# EasyEDA schematic Kit Sumo Bot Final.json
TITLE: Kit Robot Sumo V1; REV: 1.0; Date: 2023-11-24; Sheet: 1/1; Company: @amccprojects
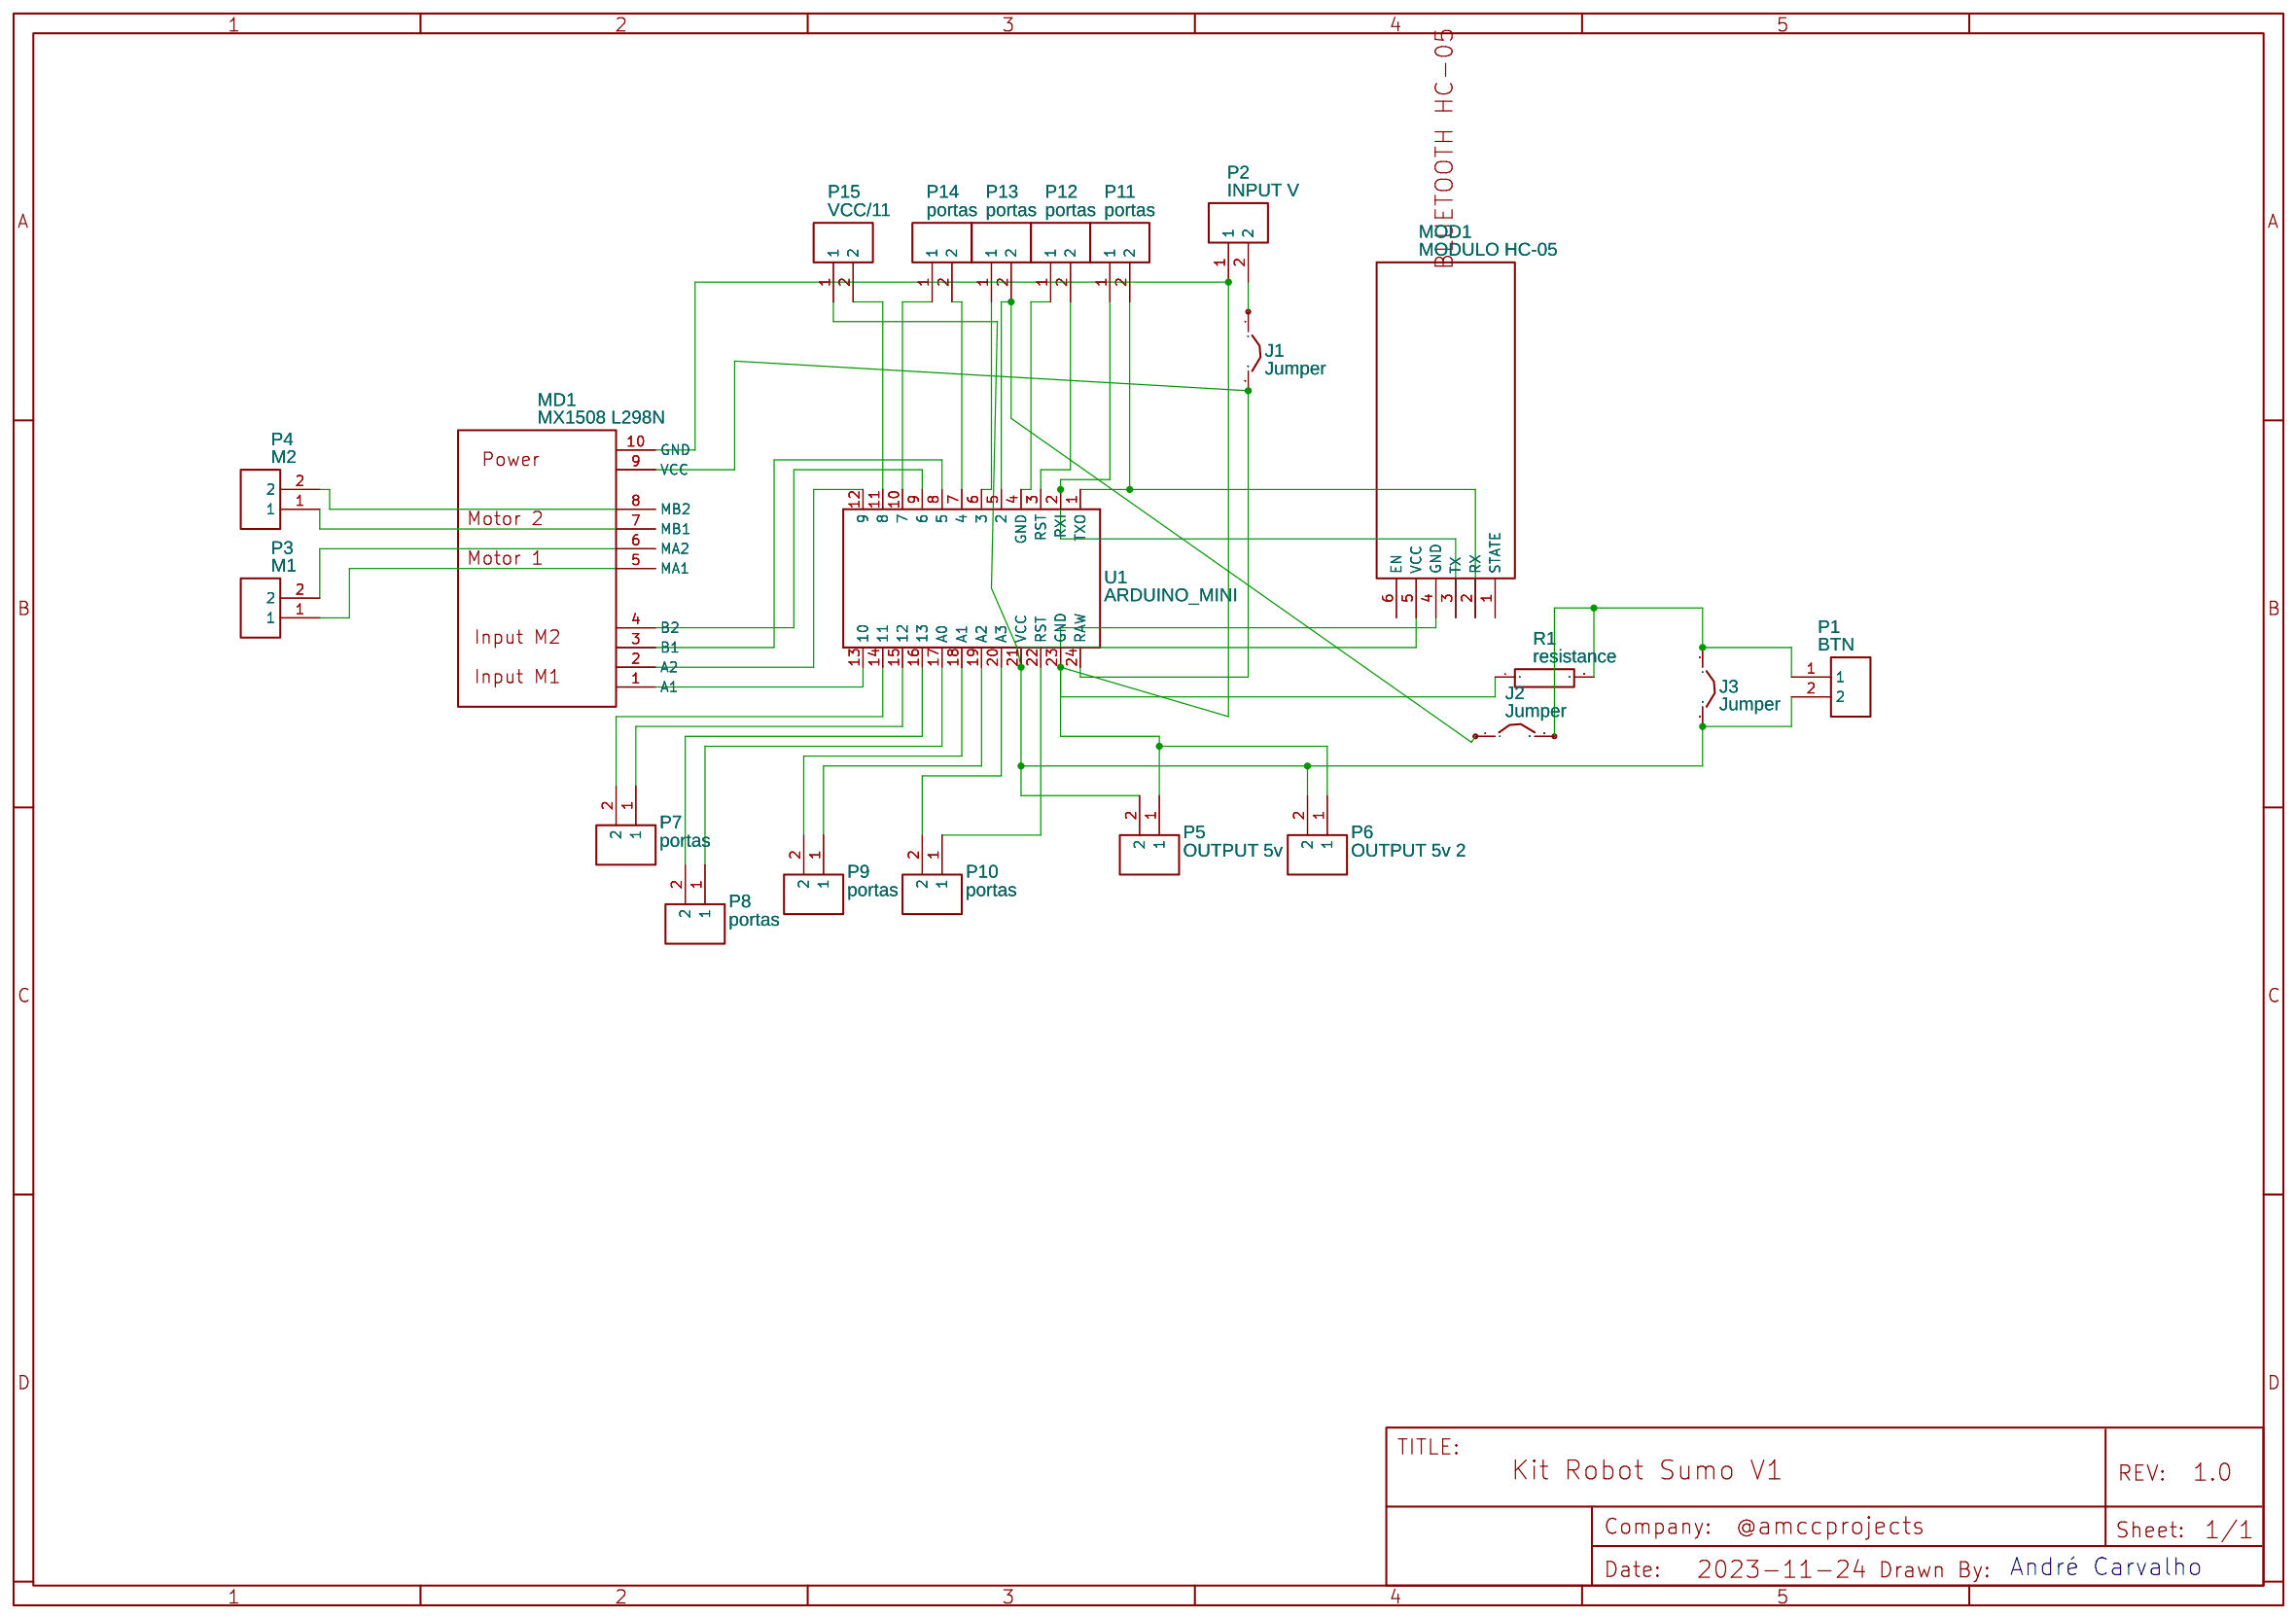
[diagram p0: schematic sheet]

## Parts
J1  Jumper  [JUMPER N]
J2  Jumper  [JUMPER N]
J3  Jumper  [JUMPER N]
MD1  MX1508 L298N  [ZS-L298N MOTOR DRIVER]
MOD1  MODULO HC-05  [MODULO HC-05]
P1  BTN  [CONN-TH_2P-P5.00_WJ500V-5.08-2P]
P2  INPUT V  [CONN-TH_2P-P5.00_WJ500V-5.08-2P]
P3  M1  [CONN-TH_2P-P5.00_WJ500V-5.08-2P]
P4  M2  [CONN-TH_2P-P5.00_WJ500V-5.08-2P]
P5  OUTPUT 5v  [CONN-TH_2P-P5.00_WJ500V-5.08-2P]
P6  OUTPUT 5v 2  [CONN-TH_2P-P5.00_WJ500V-5.08-2P]
P7  portas  [CONN-TH_2P-P5.00_WJ500V-5.08-2P]
P8  portas  [CONN-TH_2P-P5.00_WJ500V-5.08-2P]
P9  portas  [CONN-TH_2P-P5.00_WJ500V-5.08-2P]
P10  portas  [CONN-TH_2P-P5.00_WJ500V-5.08-2P]
P11  portas  [CONN-TH_2P-P5.00_WJ500V-5.08-2P]
P12  portas  [CONN-TH_2P-P5.00_WJ500V-5.08-2P]
P13  portas  [CONN-TH_2P-P5.00_WJ500V-5.08-2P]
P14  portas  [CONN-TH_2P-P5.00_WJ500V-5.08-2P]
P15  VCC/11  [CONN-TH_2P-P5.00_WJ500V-5.08-2P]
R1  resistance  [RESISTANCE]
U1  ARDUINO_MINI  [ARDUINO_MINI]

## Library data of the parts
J1-J3 = Jumper: Supplier Part: NONE; Manufacturer: NONE; Manufacturer Part: NONE; Contributor: Noej
MD1 = ZS-PWM MX1508 L298N PWM Module: Supplier: Banggood; Supplier Part: 1162946; link: https://www.banggood.com/fr/Dual-Channel-L298N-DC-Motor-Driver-Board-PWM-Speed-Dual-H-Bridge-Stepper-Module-p-1162946.html?rmmds=search&cur_warehouse=CN; Contributor: carlosplazaaguilera
MOD1 = MODULO HC-05: Contributor: guillesola
P1-P15 = WJ500V-5.08-2P-14-00A: Supplier: LCSC; Manufacturer: KANGNEX(康奈克斯电气); Manufacturer Part: WJ500V-5.08-2P; Supplier Part: C8465; JLCPCB Part Class: Extended Part; link: https://lcsc.com/eda_search?q=C8465&%26type=1&ref=editor
R1 = resistance: Contributor: ludoslash
U1 = ARDUINO_MINI: Arduino Pro Mini footprint; Contributor: SparkFun

## Nets
Net-(J1-1): J1.1 P2.2
Net-(J1-2): J1.2 MD1.9(VCC) U1.24(RAW)
Net-(J2-1): J2.1 P13.2 U1.5(2)
Net-(J2-2): J2.2 J3.1 P1.1 R1.2
Net-(J3-2): J3.2 MOD1.5(VCC) P1.2 P5.2 P6.2 P15.1 U1.21(VCC)
Net-(MD1-1): MD1.1(A1) U1.13(10)
Net-(MD1-2): MD1.2(A2) U1.12(9)
Net-(MD1-3): MD1.3(B1) U1.8(5)
Net-(MD1-4): MD1.4(B2) U1.9(6)
Net-(MD1-5): MD1.5(MA1) P3.1
Net-(MD1-6): MD1.6(MA2) P3.2
Net-(MD1-7): MD1.7(MB1) P4.1
Net-(MD1-8): MD1.8(MB2) P4.2
Net-(MD1-10): MD1.10(GND) MOD1.4(GND) P2.1 P5.1 P6.1 R1.1 U1.23(GND)
Net-(MOD1-2): MOD1.2(RX) P11.2 U1.1(TXO)
Net-(MOD1-3): MOD1.3(TX) P11.1 U1.2(RXI)
Net-(P7-1): P7.1 U1.15(12)
Net-(P7-2): P7.2 U1.14(11)
Net-(P8-1): P8.1 U1.17(A0)
Net-(P8-2): P8.2 U1.16(13)
Net-(P9-1): P9.1 U1.19(A2)
Net-(P9-2): P9.2 U1.18(A1)
Net-(P10-1): P10.1 U1.22(RST)
Net-(P10-2): P10.2 U1.20(A3)
Net-(P12-1): P12.1 U1.4(GND)
Net-(P12-2): P12.2 U1.3(RST)
Net-(P13-1): P13.1 U1.6(3)
Net-(P14-1): P14.1 U1.10(7)
Net-(P14-2): P14.2 U1.7(4)
Net-(P15-2): P15.2 U1.11(8)

Not connected (* = marked no-connect by the designer): MOD1 1(STATE) 6(EN)

## Notes on the sheet
- André Carvalho
